# EAGLE design sunbird (EAGLE 9.2.2)

## Sheet 1 of 6: Battery Charger
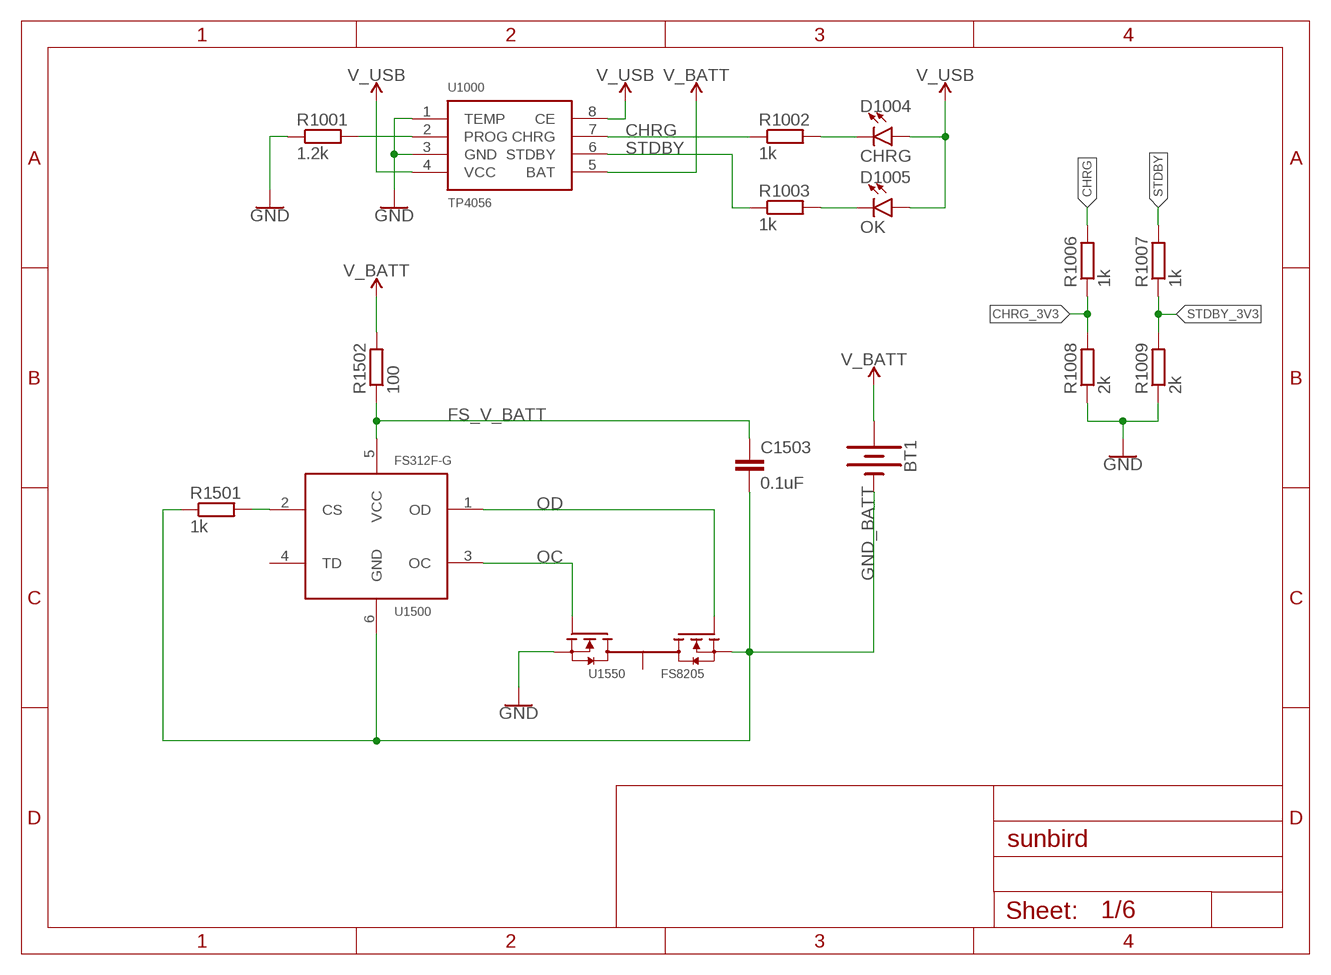
[diagram p0: schematic, sheet 1]

### Parts
BT1  BATTERY-18650  [BATTERY_18650-HOLDER]
C1503  0.1uF  C-EUC0603  [C0603]
D1004  CHRG  LED0603  [LED-0603]
D1005  OK  LED0603  [LED-0603]
R1001  1.2k  R-EU_R0603  [R0603]
R1002  1k  R-EU_R0603  [R0603]
R1003  1k  R-EU_R0603  [R0603]
R1006  1k  R-EU_R0603  [R0603]
R1007  1k  R-EU_R0603  [R0603]
R1008  2k  R-EU_R0603  [R0603]
R1009  2k  R-EU_R0603  [R0603]
R1501  1k  R-EU_R0603  [R0603]
R1502  100  R-EU_R0603  [R0603]
U1000  TP4056  [SOP-8-THERMAL]
U1500  FS312F-G  [SOT23-6]
U1550  FS8205  [SOT23-6]

### Nets
CHRG: R1002.1 R1006.2 U1000.7(CHRG)
CHRG_3V3: R1006.1 R1008.2 ; also sheet 3
FS_CS: R1501.2 U1500.2(CS)
FS_V_BATT: C1503.1 R1502.1 U1500.5(VCC)
GND: R1001.1 R1008.1 R1009.1 U1000.1(TEMP) U1000.3(GND) U1550.1(S1) ; also sheet 2,3,4,5
GND_BATT: BT1.GND@1(-) C1503.2 R1501.1 U1500.6(GND) U1550.3(S2)
N$4: R1001.2 U1000.2(PROG)
N$6: D1005.C R1003.2
N$7: D1004.C R1002.2
OC: U1500.3(OC) U1550.6(G1)
OD: U1500.1(OD) U1550.4(G2)
STDBY: R1003.1 R1007.2 U1000.6(STDBY)
STDBY_3V3: R1007.1 R1009.2 ; also sheet 3
V_BATT: BT1.PWR@1(+) R1502.2 U1000.5(BAT) ; also sheet 2,3
V_USB: D1004.A D1005.A U1000.4(VCC) U1000.8(CE) ; also sheet 5
Unconnected: U1500.4(TD) U1550.2(D12) U1550.5(D12)

## Sheet 2 of 6: Power Regulators
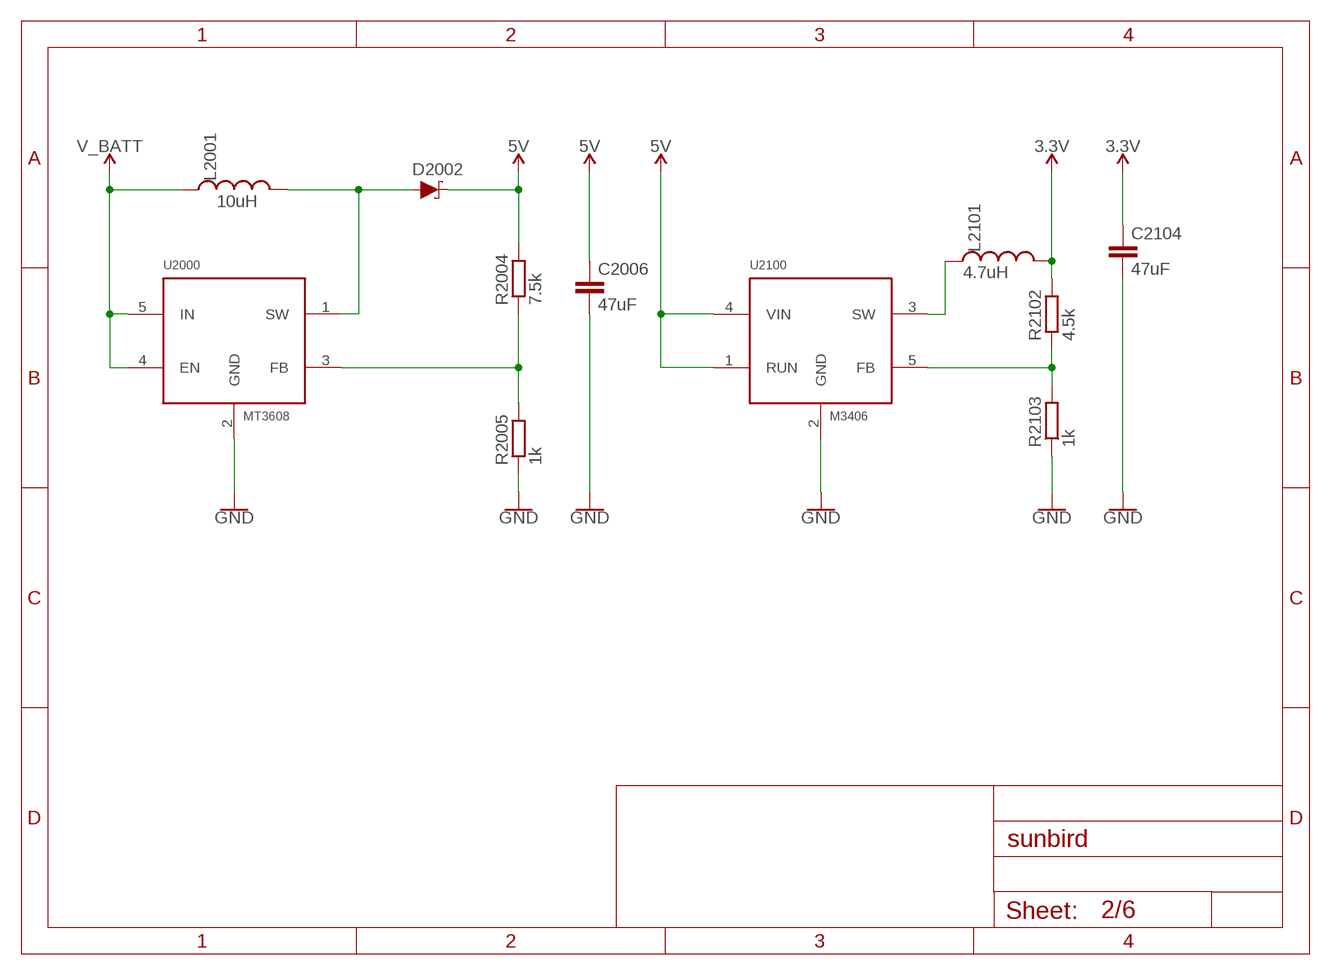
[diagram p1: schematic, sheet 2]

### Parts
C2006  47uF  C-EUC0603  [C0603]
C2104  47uF  C-EUC0603  [C0603]
D2002  DIODE-SCHOTTKY-PMEG4005EJ  [SOD-323]
L2001  10uH  INDUCTOR_3.0X3.03.0X3.0  [INDUCTOR_3.0X3.0]
L2101  4.7uH  INDUCTOR_3.0X3.03.0X3.0  [INDUCTOR_3.0X3.0]
R2004  7.5k  R-EU_R0603  [R0603]
R2005  1k  R-EU_R0603  [R0603]
R2102  4.5k  R-EU_R0603  [R0603]
R2103  1k  R-EU_R0603  [R0603]
U2000  MT3608  [SOT23-6]
U2100  M3406  [SOT23-5]

### Nets
3.3V: C2104.1 L2101.P$2 R2102.2 ; also sheet 3,5
5V: C2006.1 D2002.C R2004.2 U2100.1(RUN) U2100.4(VIN) ; also sheet 4
BUCK: D2002.A L2001.P$2 U2000.1(SW)
GND: C2006.2 C2104.2 R2005.1 R2103.1 U2000.2(GND) U2100.2(GND) ; also sheet 1,3,4,5
N$1: L2101.P$1 U2100.3(SW)
N$2: R2102.1 R2103.2 U2100.5(FB)
N$13: R2004.1 R2005.2 U2000.3(FB)
V_BATT: L2001.P$1 U2000.4(EN) U2000.5(IN) ; also sheet 1,3

### Notes on the sheet
- 10uH
- 4.7uH

## Sheet 3 of 6: Processor
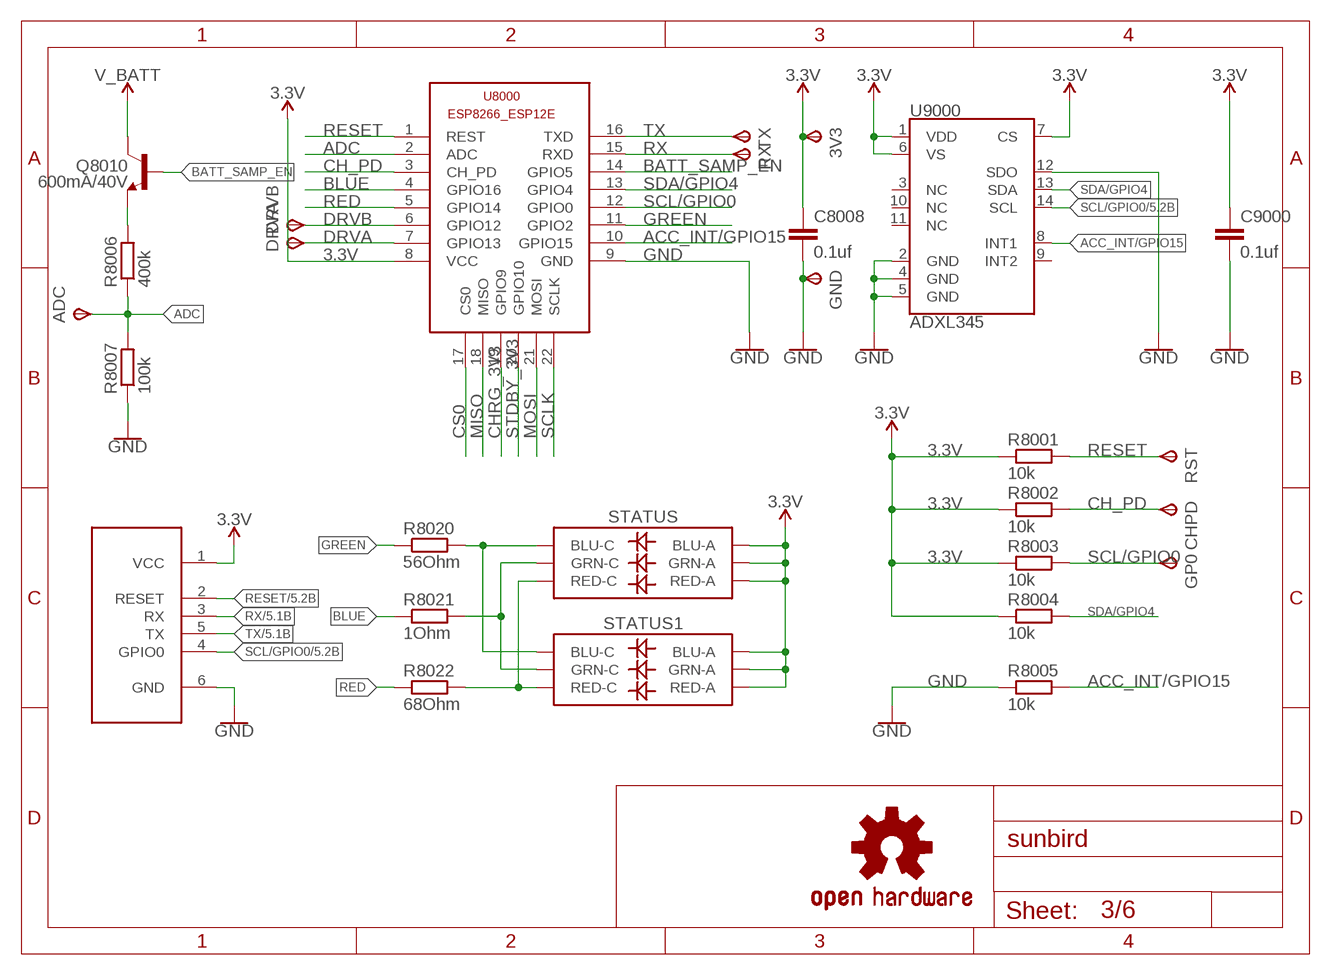
[diagram p2: schematic, sheet 3]

### Parts
3V3  TPSTP10R  [TP10R]
ADC  TPSTP10R  [TP10R]
C8008  0.1uf  C-EUC0603  [C0603]
C9000  0.1uf  C-EUC0603  [C0603]
CHPD  TPSTP10R  [TP10R]
DEBUG  ESP8266_PROGRAMMER  [TC2030-IDC-NL]
DRVA  TPSTP10R  [TP10R]
DRVB  TPSTP10R  [TP10R]
GND  TPSTP10R  [TP10R]
GP0  TPSTP10R  [TP10R]
LOGO1  OSHW-LOGOS  [OSHW-LOGO-S]
Q8010  600mA/40V  TRANS_NPN-MMBT2222AL  [SOT23-3]
R8001  10k  R-EU_R0603  [R0603]
R8002  10k  R-EU_R0603  [R0603]
R8003  10k  R-EU_R0603  [R0603]
R8004  10k  R-EU_R0603  [R0603]
R8005  10k  R-EU_R0603  [R0603]
R8006  400k  R-EU_R0603  [R0603]
R8007  100k  R-EU_R0603  [R0603]
R8020  56Ohm  R-EU_R0603  [R0603]
R8021  1Ohm  R-EU_R0603  [R0603]
R8022  68Ohm  R-EU_R0603  [R0603]
RST  TPSTP10R  [TP10R]
RX  TPSTP10R  [TP10R]
STATUS  LED-RGBNO_IC  [LED-TRICOLOR-5050]
STATUS1  LED-RGBNO_IC  [LED-TRICOLOR-5050]
TX  TPSTP10R  [TP10R]
U8000  ESP8266-12EESP8266-ESP12E  [ESP8266-ESP12E]
U9000  ADXL345  [LGA-14]

### Nets
3.3V: 3V3.TP(PP) C8008.1 C9000.1 DEBUG.1(VCC) R8001.1 R8002.1 R8003.1 R8004.1 STATUS1.1(GRN-A) STATUS1.2(RED-A) STATUS1.3(BLU-A) STATUS.1(GRN-A) STATUS.2(RED-A) STATUS.3(BLU-A) U8000.8(VCC) U9000.1(VDD) U9000.6(VS) U9000.7(CS) ; also sheet 2,5
ACC_INT/GPIO15: R8005.2 U8000.10(GPIO15) U9000.8(INT1)
ADC: ADC.TP(PP) R8006.1 R8007.2 U8000.2(ADC)
BATT_SAMP_EN: Q8010.1(B) U8000.14(GPIO5)
BLUE: R8021.1 U8000.4(GPIO16)
CH_PD: CHPD.TP(PP) R8002.2 U8000.3(CH_PD)
CHRG_3V3: U8000.19(GPIO9) ; also sheet 1
CS0: U8000.17(CS0)
DRVA: DRVA.TP(PP) U8000.7(GPIO13) ; also sheet 4
DRVB: DRVB.TP(PP) U8000.6(GPIO12) ; also sheet 4
GND: C8008.2 C9000.2 DEBUG.6(GND) GND.TP(PP) R8005.1 R8007.1 U8000.9(GND) U9000.2(GND) U9000.4(GND) U9000.5(GND) U9000.12(SDO) ; also sheet 1,2,4,5
GREEN: R8020.1 U8000.11(GPIO2)
MISO: U8000.18(MISO)
MOSI: U8000.21(MOSI)
N$9: Q8010.2(E) R8006.2
N$14: R8020.2 STATUS1.4(BLU-C) STATUS.4(BLU-C)
N$15: R8021.2 STATUS1.6(GRN-C) STATUS.6(GRN-C)
N$16: R8022.2 STATUS1.5(RED-C) STATUS.5(RED-C)
RED: R8022.1 U8000.5(GPIO14)
RESET: DEBUG.2(RESET) R8001.2 RST.TP(PP) U8000.1(REST) ; also sheet 5
RX: DEBUG.3(RX) RX.TP(PP) U8000.15(RXD) ; also sheet 5
SCL/GPIO0: DEBUG.4(GPIO0) GP0.TP(PP) R8003.2 U8000.12(GPIO0) U9000.14(SCL) ; also sheet 5
SCLK: U8000.22(SCLK)
SDA/GPIO4: R8004.2 U8000.13(GPIO4) U9000.13(SDA)
STDBY_3V3: U8000.20(GPIO10) ; also sheet 1
TX: DEBUG.5(TX) TX.TP(PP) U8000.16(TXD) ; also sheet 5
V_BATT: Q8010.3(C) ; also sheet 1,2
Unconnected: U9000.3(NC) U9000.9(INT2) U9000.10(NC) U9000.11(NC)

## Sheet 4 of 6: Motor Driver
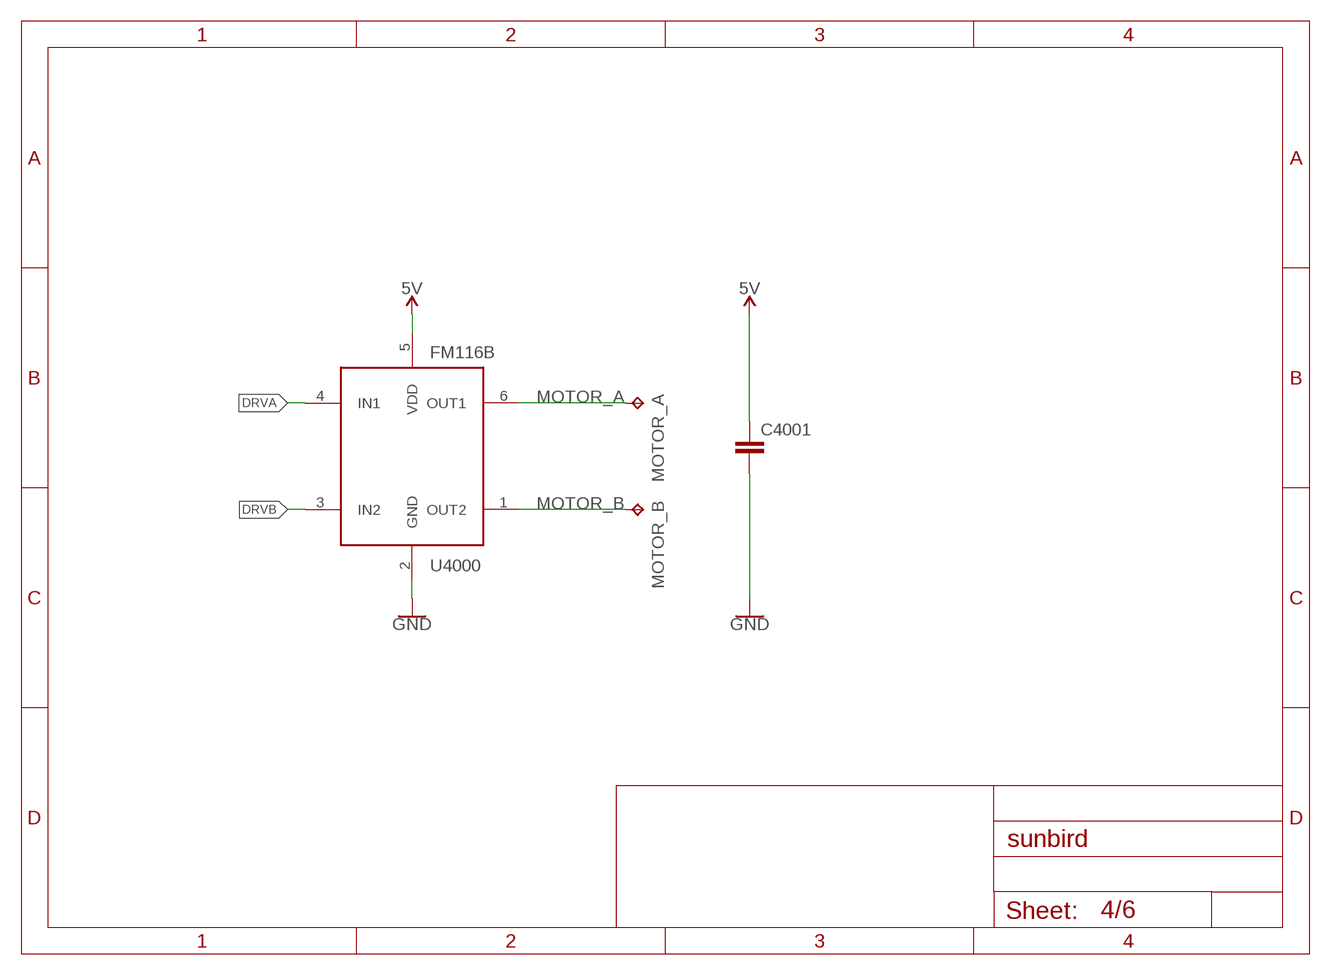
[diagram p3: schematic, sheet 4]

### Parts
C4001  C-EUC0603  [C0603]
MOTOR_A  TPTP20SQ  [TP20SQ]
MOTOR_B  TPTP20SQ  [TP20SQ]
U4000  FM116B  [SOT23-6]

### Nets
5V: C4001.1 U4000.5(VDD) ; also sheet 2
DRVA: U4000.4(IN1) ; also sheet 3
DRVB: U4000.3(IN2) ; also sheet 3
GND: C4001.2 U4000.2(GND) ; also sheet 1,2,3,5
MOTOR_A: MOTOR_A.TP U4000.6(OUT1)
MOTOR_B: MOTOR_B.TP U4000.1(OUT2)

## Sheet 5 of 6: USB/UART
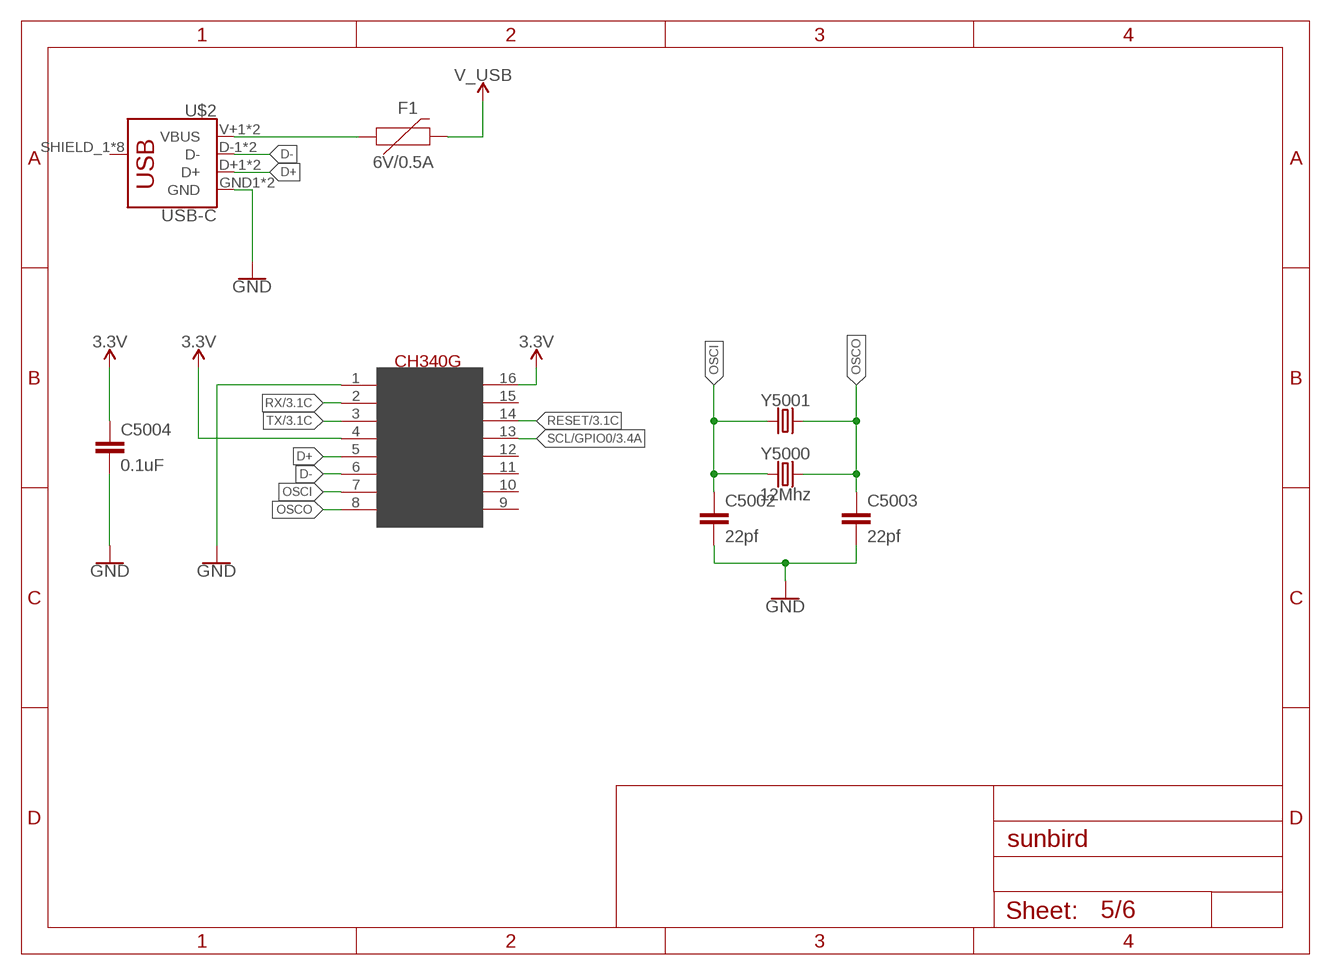
[diagram p4: schematic, sheet 5]

### Parts
C5002  22pf  C-EUC0603  [C0603]
C5003  22pf  C-EUC0603  [C0603]
C5004  0.1uF  C-EUC0603  [C0603]
F1  6V/0.5A  PPTC_HALF-AMP  [1206]
U5000  CH340G  [SOIC16]
U$2  USB-C  [USB_C-XKBENTERPRISEU262-16XN-4BVC11]
Y5000  12Mhz  CRYSTALSMD-HC49UP  [HC49UP]
Y5001  CRYSTALPTH-HC49UV  [HC49U]

### Nets
3.3V: C5004.1 U5000.4(V3) U5000.16(VCC) ; also sheet 2,3
D+: U5000.5(D+) U$2.D+1(D+) U$2.D+2(D+)
D-: U5000.6(D-) U$2.D-1(D-) U$2.D-2(D-)
GND: C5002.2 C5003.2 C5004.2 U5000.1(GND) U$2.GND1(GND) U$2.GND2(GND) ; also sheet 1,2,3,4
OSCI: C5002.1 U5000.7(XI) Y5000.1 Y5001.1
OSCO: C5003.1 U5000.8(XO) Y5000.2 Y5001.2
RESET: U5000.14(RTS) ; also sheet 3
RX: U5000.2(TX) ; also sheet 3
SCL/GPIO0: U5000.13(DTR) ; also sheet 3
TX: U5000.3(RX) ; also sheet 3
V_USB: F1.2 ; also sheet 1
V_USB_UNFUSED: F1.1 U$2.V+1(VBUS) U$2.V+2(VBUS)
Unconnected: U5000.9(CTS) U5000.10(DSR) U5000.11(RI) U5000.12(DCD) U5000.15(RS232) U$2.SHIELD_1(SHIELD) U$2.SHIELD_2(SHIELD) U$2.SHIELD_3(SHIELD) U$2.SHIELD_4(SHIELD) U$2.SHIELD_5(SHIELD) U$2.SHIELD_6(SHIELD) U$2.SHIELD_7(SHIELD) U$2.SHIELD_8(SHIELD)

## Sheet 6 of 6

## Library data of the parts
3V3 ADC CHPD DRVA DRVB GND GP0 RST RX TX = testpad:TPS: TEST PIN
BT1 = SparkFun-Batteries:BATTERY: Battery - Single Cell A variety of battery chemistries, sizes, and footprints. Device List: 20MM_PTH - Coin Cell Battery Holder - 20mm (PTH) <https://www.sparkfun.com/products/783> 6.8MM_PTH - Coin Cell Battery Holder - 6.8MM(SMD) <https://www.digikey.com/product-detail/en/seiko-instruments/MS621FE-FL11E/728-1057-ND/1889208?WT.srch=1&gclid=CNOQ5a6LzdQCFZS2wAodXCkE0g> 12MM_SMD - Coin Cell Battery Holder - 12mm (SMD) <https://www.sparkfun.com/products/10592> 12MM_PTH - Coin Cell Battery Holder - 12mm (PTH) <https://www.sparkfun.com/products/7948> 20MM_SMD - 20mm Coin Cell Battery Holder (SMD) (2 legs) Used on the Big Time Watch Kit <https://www.sparkfun.com/products/11734> 20MM_SMD_4LEGS - Coin Cell Battery Holder - 20mm (SMD) <https://www.sparkfun.com/products/11892> 20MM_SMD_4LEGS_OVERPASTE - Coin Cell Battery Holder - 20mm (SMD) <https://www.sparkfun.com/products/11892> (Over-paste on the legs) 24.5MM_PTH - Coin Cell Battery Holder - 24.5mm (PTH) <https://www.sparkfun.com/products/8863> 9V - 9V Battery Holder - PC Mount Used on the SparkFun SparkPunk Sound Kit <https://www.sparkfun.com/products/11177> and SparkFun SparkPunk Sequencer Kit <https://www.sparkfun.com/products/12707> 18650 - Battery Holder - 18650 (PTH) <https://www.sparkfun.com/products/13113> AA - Battery Holder - 1xAA (PTH) <https://www.sparkfun.com/products/7949> AAA - Battery Holder - 1xAAA (PTH) <https://www.sparkfun.com/products/12718> AA_KIT - Battery Holder - 1xAA (PTH) <https://www.sparkfun.com/products/7949> Special kit package - pads only have exposed copper on one side of the board. AAA_KIT - Battery Holder - 1xAAA (PTH) <https://www.sparkfun.com/products/12718> Special kit package - pads only have exposed copper on one side of the board.; PROD_ID: BATT-12327; SF_SKU: PRT-13113
C1503 C2006 C2104 C4001 C5002-C5004 C8008 C9000 = rcl:C-EU: CAPACITOR, European symbol; SPICEPREFIX: C
D1004 D1005 = SparkFun-LED:LED: LED (Generic) Standard schematic elements and footprints for 5mm, 3mm, 1206, and 0603 sized LEDs. Generic LEDs with no color specified.
D2002 = SparkFun-DiscreteSemi:DIODE-SCHOTTKY: Schottky diode A Schottky diode is a semiconductor diode which has a low forward voltage drop and a very fast switching action.; PROD_ID: DIO-10955; VALUE: 0.5A/40V/420mV
DEBUG = geusebio:ESP8266_PROGRAMMER
F1 = SparkFun-Fuses:PPTC: Resettable Fuse PPTC Resettable Fuse. Really a sort of resistor with a polymeric positive temperature coefficient whose resistance increases dramatically with an increase in temperature. When heated by the power passing through the resistance rises causing the current to be limited, protecting the circuit. This is achieved by the transition of the polymer from a crystalline to an amorphous state where the conductive carbon separates breaking the conductive pathways found in the cool crystalline structure. When a PPTC cools back down it resumes conducting letting the circuit turn back on. SparkFun Products: SparkFun RedBoard - Programmed with Arduino <https://www.sparkfun.com/products/12757> Pro Micro - 5V/16MHz <https://www.sparkfun.com/products/12640> Arduino Pro 328 - 5V/16MHz <https://www.sparkfun.com/products/10915> MP3 Trigger <https://www.sparkfun.com/products/13720>; PROD_ID: RES-08585
L2001 L2101 = geusebio:INDUCTOR_3.0X3.0
LOGO1 = SparkFun-Aesthetics:OSHW-LOGO: Open-Source Hardware (OSHW) Logo This logo indicates the piece of hardware it is found on incorporates a OSHW license and/or adheres to the definition of open source hardware found here: http://freedomdefined.org/OSHW
MOTOR_A MOTOR_B = testpad:TP: Test pad
Q8010 = SparkFun-DiscreteSemi:TRANS_NPN: NPN transistor Current controlled devices typically used to amplify current or used as a switch. BC547 - COM-08928 <http://www.sparkfun.com/products/8928> (TO-92 45V 100mA) (1.Collector 2.Base 3.Emitter) 2N3904 - COM-00521 <http://www.sparkfun.com/products/521> (TO-92 40V 200mA) (1.Emitter 2.Base 3.Collector) P2N2222A - COM-12852 <http://www.sparkfun.com/products/12852> (TO-92 40V 600mA) (1.Collector 2.Base 3.Emitter); PROD_ID: TRANS-08049
R1001-R1003 R1006-R1009 R1501 R1502 R2004 R2005 R2102 R2103 R8001-R8007 R8020-R8022 = rcl:R-EU_: RESISTOR, European symbol; SPICEPREFIX: R
STATUS STATUS1 = SparkFun-LED:LED-RGB: LED-RGB 6 pin RGB LED (no common connector) Packages: PLCC-6 LED-TRICOLOR-5050 - No built-in IC SparkFun Products: Digital Sandbox <https://www.sparkfun.com/products/12651> LED- SMD RGB <https://www.sparkfun.com/products/10866>; PROD_ID: DIO-10298
U1000 = geusebio:TP4056
U1500 = geusebio:FS312F-G
U1550 = geusebio:FS8205
U2000 = geusebio:MT3608
U2100 = geusebio:M3406
U4000 = geusebio:FM116B
U5000 = CH340G-USB-SERIAL:CH340G
U8000 = ESP8266-ESP12E:ESP8266-12E: ESP8266-12E with additional I/O and GPIO04/05 corrected The author cannot warrant that this library is free from error or will meet your specific requirements. Created by PuceBaboon.com. Komagane, Nagano, JAPAN
U9000 = SparkFun-Sensors:ADXL345: Analog Devices ADXL345 3-Axis SPI/I2C 2/4/8/16g Accelerometer The ADXL345 is a small, thin, low power, 3-axis accelerometer with high resolution (13-bit) measurement at up to ±16g. Digital output data is formatted as 16-bit twos complement and is accessible through either a SPI (3- or 4-wire) or I2C digital interface. Datasheet <https://www.sparkfun.com/datasheets/Sensors/Accelerometer/ADXL345.pdf> SparkFun Products SparkFun Triple Axis Accelerometer Breakout - ADXL345 <https://www.sparkfun.com/products/9836> (SEN-09836) Triple Axis Accelerometer - ADXL345 <https://www.sparkfun.com/products/9045> (SEN-09045) SparkFun 6 Degrees of Freedom IMU Digital Combo Board - ITG3200/ADXL345 <https://www.sparkfun.com/products/10121> (SEN-10121); PROD_ID: IC-09097; SF_ID: SEN-09045
U$2 = geusebio:USB-C
Y5000 Y5001 = SparkFun-Clocks:CRYSTAL: Crystals (Generic) These are passive quartz crystals, which can be used as a clock source for a microcontroller. Crystal's are two-terminal devices. They require external "load" capacitors to generate an oscillating signal.

## Board
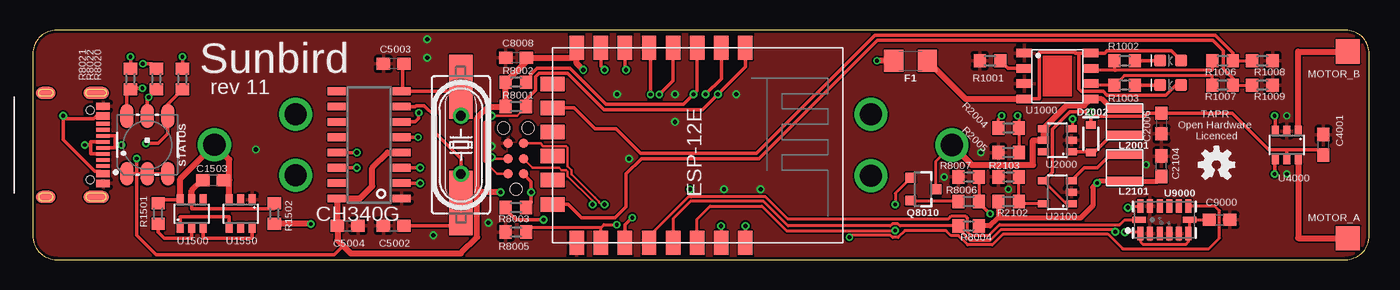
[diagram p5: board, top side]
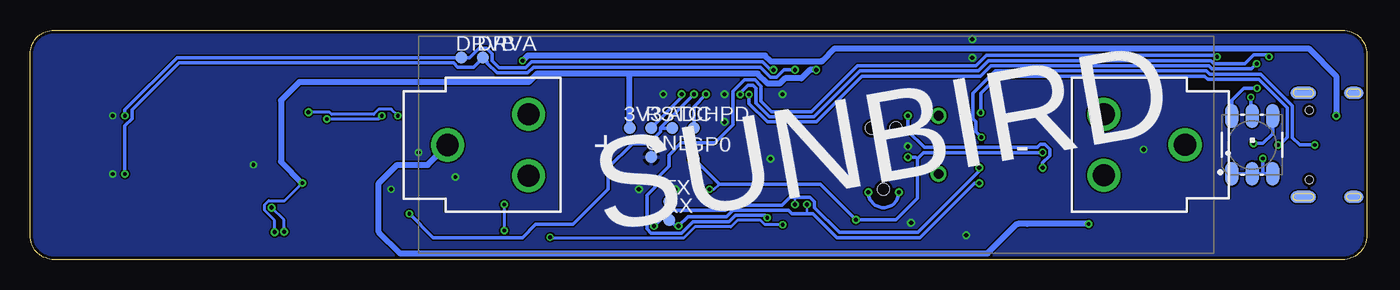
[diagram p6: board, bottom side, seen from below]

Size 111 x 19.05 mm. Coordinates in mm from the lower left corner, seen from the top.
Outline: 0,17.05 0,2 arc90 2,0 109,0 arc90 111,2 111,17.05 arc90 109,19.05 2,19.05 arc90 0,17.05
Copper layers (1*16): Top 0.035mm / dielectric 1.5mm / Bottom 0.035mm
Design rules "dirtypcbs": minimum track width 5mil, minimum drill 12mil, track to track 5mil, track to pad 5mil, pad to pad 5mil, via to via 5mil, smd to smd 0mil, copper to edge 10mil, drill to drill 10mil, minimum pad ring 10mil, minimum via ring 6mil, stop-mask expansion 2mil, vias tented up to drill 25mil, thermal gap 10mil
tKeepout: area 0,17.8 to 111,19; area 0,0 to 111,1.3
bKeepout: area 81,0 to 111,19.1

### Footprints (pad centres in the part's own frame; a part is rotated, then mirrored left to right if it is on the bottom)
TP10R = smd 1 x 1: TP 0,0
BATTERY_18650-HOLDER = drill 1.829: GND@1 30.628,0.01; GND@2 23.88,2.55; GND@3 23.88,-2.53; PWR@1 -30.628,-0.01; PWR@2 -23.88,2.53; PWR@3 -23.88,-2.55
C0603 = smd 1.1 x 1: 1 -0.85,0; 2 0.85,0
LED-0603 = smd 1 x 1: A -0.877,0; C 0.877,0
SOD-323 = smd 0.63 x 0.83: A 1.15,0; C -1.15,0
TC2030-IDC-NL = smd 0.787 x 0.787: 1 -1.27,-0.635; 2 -1.27,0.635; 3 0,-0.635; 4 0,0.635; 5 1.27,-0.635; 6 1.27,0.635 | hole 0.991: -2.54,0; 2.54,1.016; 2.54,-1.016
1206 = smd 1.6 x 1.8: 1 -1.4,0; 2 1.4,0
INDUCTOR_3.0X3.0 = smd 0.75 x 3: P$1 -1.125,0; P$2 1.125,0
TP20SQ = smd 2 x 2: TP 0,0
SOT23-3 = smd 0.8 x 0.9: 1 -0.95,-1; 2 0.95,-1; 3 0,1.1
R0603 = smd 1 x 1.1: 1 -0.85,0; 2 0.85,0
LED-TRICOLOR-5050 = smd 2 x 1.1: 1 -2.4,1.7; 2 -2.4,0; 3 -2.4,-1.7; 4 2.4,-1.7; 5 2.4,0; 6 2.4,1.7
SOP-8-THERMAL = smd 1.3 x 0.7: 1 -2.75,1.905; 2 -2.75,0.635; 3 -2.75,-0.635; 4 -2.75,-1.905; 5 2.75,-1.905; 6 2.75,-0.635; 7 2.75,0.635; 8 2.75,1.905
SOT23-6 = smd 0.6 x 0.9: 1 -0.95,-1.15; 2 0,-1.15; 3 0.95,-1.15; 4 0.95,1.15; 5 0,1.15; 6 -0.95,1.15
SOT23-5 = smd 0.6 x 0.9: 1 -0.95,-1.15; 2 0,-1.15; 3 0.95,-1.15; 4 0.95,1.15; 5 -0.95,1.15
SOIC16 = smd 0.635 x 1.524: 1 -4.445,-2.695; 2 -3.175,-2.695; 3 -1.905,-2.695; 4 -0.635,-2.695; 5 0.635,-2.695; 6 1.905,-2.695; 7 3.175,-2.695; 8 4.445,-2.695; 9 4.445,2.695; 10 3.175,2.695; 11 1.905,2.695; 12 0.635,2.695; 13 -0.635,2.695; 14 -1.905,2.695; 15 -3.175,2.695; 16 -4.445,2.695
ESP8266-ESP12E = smd 2 x 1.2: 1 0,16; 2 0,14; 3 0,12; 4 0,10; 5 0,8; 6 0,6; 7 0,4; 8 0,2; 9 16.2,2; 10 16.2,4; 11 16.2,6; 12 16.2,8; 13 16.2,10; 14 16.2,12; 15 16.2,14; 16 16.2,16 | smd 1.2 x 2: 17 11,0; 18 3,0; 19 5,0; 20 13,0; 21 7,0; 22 9,0
LGA-14 = smd 0.5 x 1.124: 1 2,1.138; 2 1.2,1.138; 3 0.4,1.138; 4 -0.4,1.138; 5 -1.2,1.138; 6 -2,1.138; 8 -2,-1.13; 9 -1.2,-1.138; 10 -0.4,-1.138; 11 0.4,-1.138; 12 1.2,-1.138; 13 2,-1.138 | smd 1.124 x 0.5: 7 -2.1,0; 14 2.1,0
USB_C-XKBENTERPRISEU262-16XN-4BVC11 = smd 0.3 x 1.15: CC1 -1.25,0; CC2 1.75,0; D+1 -0.25,0; D+2 0.75,0; D-1 -0.75,0; D-2 0.25,0; SBU1 1.25,0; SBU2 -1.75,0 | smd 0.6 x 1.15: GND1 -3.2,0; GND2 3.2,0; V+1 -2.4,0; V+2 2.4,0 | smd 1 x 1.6 bottom: SHIELD_1 -4.32,-4.755; SHIELD_8 4.32,-4.755 | smd 1 x 2.1 bottom: SHIELD_2 -4.32,-0.575; SHIELD_7 4.32,-0.575 | smd 1 x 1.6: SHIELD_3 -4.32,-4.755; SHIELD_6 4.32,-4.755 | smd 1 x 2.1: SHIELD_4 -4.32,-0.575; SHIELD_5 4.32,-0.575 | hole 0.65: -2.89,-1.075; 2.89,-1.075
HC49UP = smd 5.334 x 1.93: 1 -4.826,0; 2 4.826,0
HC49U = drill 0.813: 1 -2.413,0; 2 2.413,0

### Placement (x,y rotation side)
3V3  61.21,10.92 0 bottom
ADC  57.66,10.92 0 bottom
BT1  45.72,9.53 0 bottom
C1503  14.99,6.6 0 top
C2006  93.73,11.3 270 top
C2104  93.73,7.75 90 top
C4001  107.19,9.53 90 top
C5002  29.97,2.79 180 top
C5003  29.97,16.26 180 top
C5004  26.16,2.79 0 top
C8008  40.13,16.76 180 top
C9000  98.55,3.3 0 top
CHPD  55.88,10.92 0 bottom
D1004  94.49,16.51 180 top
D1005  94.49,14.48 180 top
D2002  87.88,10.03 270 top
DEBUG  40.13,8.38 90 top
DRVA  73.41,16.76 0 bottom
DRVB  75.18,16.76 0 bottom
F1  72.9,16.51 0 top
GND  59.44,8.51 0 bottom
GP0  55.88,8.38 0 bottom
L2001  90.68,11.43 270 top
L2101  90.68,7.62 270 top
LOGO1  98.3,7.87 0 top
MOTOR_A  109.22,1.78 0 top
MOTOR_B  109.22,17.27 0 top
Q8010  73.91,5.84 270 top
R1001  79.5,16.51 0 top
R1002  90.68,16.51 0 top
R1003  90.68,14.48 0 top
R1006  98.81,16.51 180 top
R1007  98.81,14.48 180 top
R1008  102.11,16.51 180 top
R1009  102.11,14.48 180 top
R1501  10.41,3.81 270 top
R1502  20.07,3.81 270 top
R2004  81.03,10.92 180 top
R2005  81.03,8.89 0 top
R2102  81.03,4.83 180 top
R2103  81.03,6.86 0 top
R8001  40.13,12.7 0 top
R8002  40.13,14.73 0 top
R8003  40.13,4.32 180 top
R8004  77.72,2.79 180 top
R8005  40.13,2.29 0 top
R8006  77.72,4.83 180 top
R8007  77.72,6.86 0 top
R8020  12.45,14.99 270 top
R8021  8.13,14.99 270 top
R8022  10.29,14.99 270 top
RST  59.44,10.92 0 bottom
RX  57.91,3.3 0 bottom
STATUS  9.53,9.53 90 top
STATUS1  9.53,9.53 90 bottom
TX  57.91,4.83 0 bottom
U1000  85.09,15.24 0 top
U1500  13.21,3.81 0 top
U1550  17.27,3.81 180 top
U2000  85.09,9.91 90 top
U2100  85.09,5.59 90 top
U4000  104.14,9.53 180 top
U5000  27.94,9.53 90 top
U8000  43.18,17.59 270 top
U9000  93.98,3.3 180 top
U$2  5.84,9.53 270 top
Y5000  35.56,9.53 90 top
Y5001  35.56,9.53 90 top

### Tracks (layer width: path | path; a pad name or v marks a point on that pad's centre or on a via)
3.3V  (via drill 0.3, 0.35)
  Top 0.254: v90.7,2.29 91.86,2.29 U9000.1 91.98,1.49 92.2,1.27 95.76,1.27 95.98,1.49 U9000.6 96.08,2.26 U9000.7 C9000.1
  Top 0.305: DEBUG.1 41.4,6.48 v41.4,5.59 41.4,4.74 R8003.1 | 45.18,17.27 U8000.8 | 25.78,1.14 25.04,0.41 10.26,0.41 8.64,2.03 8.64,7.12 | STATUS1.3 STATUS1.2 | STATUS1.2 STATUS1.1 | STATUS1.2 8.64,7.12 | 8.64,7.12 v8.64,8.38
  Top 0.406: C2104.1 93.32,6.5 L2101.P$2 88.54,6.5 v88.39,6.35 88.04,5.99 88.04,4.46 87.02,3.44 80.15,3.44 | 80.15,3.44 80.18,3.47 R2102.2 | 80.15,3.44 79.5,2.79 R8004.1
  Top 0.508: v45.72,15.75 45.18,16.29 45.18,17.27 | 36.91,5.59 36.91,1.87 35.54,0.51 26.42,0.51 25.78,1.14 25.31,1.61 C5004.1 25.31,5.01 U5000.16 27.18,5.08 28.19,6.1 28.19,7.62 29.46,8.89 U5000.4 | v38.86,5.59 36.91,5.59 | 36.91,5.59 36.91,11.76 37.85,12.7 R8001.1 R8002.1 40.98,16.43 C8008.1 45.18,16.76 U8000.8
  Bottom 0.254: v88.39,6.35 89.84,4.9 91.17,4.9 91.51,4.56 91.51,4.08 90.7,3.26 v90.7,2.29
  Bottom 0.305: v38.86,5.59 arc180 v41.4,5.59 | STATUS1.3 8.64,7.12 | 8.64,7.12 STATUS1.2 STATUS1.1 | v8.64,8.38 8.64,7.12
  Bottom 0.508: 61.21,15.44 50.58,15.44 49.75,14.61 48.77,14.61 48.34,15.04 46.95,15.04 46.24,15.75 v45.72,15.75 | 3V3.TP 61.21,15.44 | 61.21,15.44 68.89,15.44 69.6,14.73 88.65,14.73 90.17,13.21 90.17,8.13 v88.39,6.35
5V  (via drill 0.3, 0.35)
  Top 0.254: R2004.2 80.18,11.66 v80.45,11.94 | U2100.4 85.84,4.64 U2100.1
  Top 0.305: D2002.C v87.88,12.24 | C4001.1 106.76,9.1 104.14,9.1 | 104.14,9.1 102.66,9.1 99.61,12.15 C2006.1 92.55,12.15 92.29,11.9 88.23,11.9 v87.88,12.24 | U4000.5 104.14,9.1 | U2100.4 84.67,7.27 84.67,10.82 86.12,12.27 87.86,12.27 v87.88,12.24
  Bottom 0.254: v80.45,11.94 81.01,12.5 82.04,12.5 82.47,12.06 85.95,12.06 86.13,12.24 v87.88,12.24
ACC_INT/GPIO15  (via drill 0.3)
  Top 0.254: U8000.10 47.18,2.64 | R8005.2 40.98,2.64 47.18,2.64 | 47.18,2.64 47.43,2.9 v48.51,2.9 | v67.82,1.85 68,2.03 71.22,2.03 71.4,1.85 71.86,1.85 72.42,2.41 75.85,2.41 76.27,1.99 76.89,1.99 77.65,1.23 79.69,1.23 80.59,2.13 89.27,2.13 90.52,0.89 97.66,0.89 98.55,1.78 98.55,4.06 98.18,4.43 U9000.8
  Bottom 0.254: v48.51,2.9 49.99,2.9 50.34,3.25 50.34,3.26 52.27,3.26 52.81,2.72 55.79,2.72 56.73,1.78 58.92,1.78 58.93,1.78 67.74,1.78 v67.82,1.85
ADC  (via drill 0.3, 0.35)
  Top 0.254: R8007.2 R8006.1
  Top 0.305: U8000.2 57.18,15.02 v55.88,13.72 | v79.5,3.81 78.57,4.74 R8006.1
  Bottom 0.305: 58.66,10.92 58.66,10.6 59.62,9.63 60.98,9.63 62.99,7.62 62.99,5.84 65.91,2.92 69.01,2.92 70.1,1.83 77.52,1.83 v79.5,3.81 | 58.66,10.92 58.66,10.94 v55.88,13.72 | ADC.TP 58.66,10.92
BATT_SAMP_EN  (via drill 0.3)
  Top 0.254: U8000.14 55.18,3.36 56.26,4.45 60.55,4.45 62.58,2.41 v71.63,2.41 | Q8010.1 71.63,5.51 v71.63,4.57
  Bottom 0.254: v71.63,4.57 v71.63,2.41
BLUE  (via drill 0.3)
  Top 0.305: v52.05,13.72 53.18,14.85 U8000.4 | v8.13,16.84 R8021.1
  Bottom 0.305: v52.05,13.72 52.05,13.81 51.37,14.48 50.98,14.48 50.72,14.22 50.72,12.98 49.6,11.86 45.9,11.86 42.09,15.67 32.27,15.67 31.41,16.52 12.96,16.52 12.69,16.26 10.13,16.26 9.4,16.99 8.28,16.99 v8.13,16.84
BUCK
  Top 0.305: U2000.1 87.88,8.96 | 87.88,8.96 D2002.A | L2001.P$2 89.55,10.3 88.2,8.96 87.88,8.96
CH_PD  (via drill 0.35)
  Top 0.305: R8002.2 41.33,15.08 41.33,15.35 41.88,15.9 44.6,15.9 47.63,12.88 54.03,12.88 v54.86,13.72 55.18,14.03 U8000.3
  Bottom 0.305: CHPD.TP 55.88,12.7 v54.86,13.72
CHRG
  Top 0.254: R1006.2 97.96,15.71 89.92,15.71 | U1000.7 87.84,15.71 89.92,15.71 | R1002.1 89.83,15.71 89.92,15.71
CHRG_3V3
  Top 0.254: R1006.1 R1008.2
  Top 0.305: U8000.19 44.96,12.59 46.7,10.85 48.44,10.85 50.47,8.81 60.12,8.81 69.95,18.64 98.2,18.64 99.66,17.18 R1006.1
D+  (via drill 0.3)
  Top 0.305: v32,10.16 U5000.5 | U$2.D+2 4.83,8.78 4.83,9.4 4.83,9.53 | 4.83,9.53 4.83,9.78 U$2.D+1 | v4.32,9.53 4.83,9.53
  Bottom 0.305: v32,10.16 32.45,10.6 32.45,11.43 32.7,11.68 32.7,13.79 30.84,15.66 13.31,15.66 13.05,15.39 8.79,15.39 6.17,12.78 6.17,10.11 5.59,9.53 v4.32,9.53
D-  (via drill 0.3)
  Top 0.305: v32.07,12.19 32.07,11.75 31.75,11.43 U5000.6 | U$2.D-2 6.86,9.28 6.86,9.53 | U$2.D-1 6.86,10.28 6.86,9.65 6.86,9.53 | v7.37,9.53 6.86,9.53
  Bottom 0.305: v32.07,12.19 32.07,13.82 30.66,15.23 13.49,15.23 13.22,14.96 8.97,14.96 6.6,12.6 6.6,10.16 7.24,9.53 v7.37,9.53
DRVA  (via drill 0.3, 0.35)
  Top 0.305: U8000.7 47.18,16.07 v47.5,15.75 | U4000.4 103.12,8.31 v103.12,7.11
  Bottom 0.305: v47.5,15.75 48.41,15.75 49.02,15.14 49.53,15.14 50.36,15.98 69.2,15.98 69.68,15.49 72.24,15.49 73.06,16.31 73.06,16.42 DRVA.TP 74.19,15.98 75.51,15.98 75.85,16.33 98.63,16.33 102.54,12.42 102.54,11.7 103.12,11.11 v103.12,7.11
DRVB  (via drill 0.3, 0.35)
  Top 0.305: U8000.6 49.18,15.84 v49.28,15.75 | v103.12,11.94 103.19,11.87 U4000.3
  Bottom 0.305: v49.28,15.75 49.52,15.75 50.18,16.41 69.38,16.41 69.86,15.93 72.06,15.93 72.63,16.49 72.63,17.09 73.08,17.54 73.73,17.54 74.51,16.76 DRVB.TP 98.81,16.76 103.12,12.45 v103.12,11.94
FS_CS
  Top 0.305: U1500.2 13.21,1.78 10.92,1.78 10.41,2.29 R1501.2
FS_V_BATT
  Top 0.305: U1500.5 13.21,4.21 20.07,4.21 R1502.1
  Top 0.508: U1500.5 13.21,5.75 14.06,6.6 C1503.1
GND  (via drill 0.3, 0.35)
  other vias: 49.53,8.38 33.27,2.03 32.77,18.29 38.1,9.4 37.85,3.05 32.77,16.76 48.51,13.72 53.34,11.43 53.34,13.72 18.54,9.14 60.45,5.84 57.4,5.84 92.46,7.87 104.14,7.11 104.14,11.94 78.74,8.89 75.69,6.86 81.03,5.84 58.42,13.72
  pour Top: -7.62,21 123.44,21 123.44,-1 -7.62,-1
  pour Bottom: -5.33,20 126.49,20 126.49,-2 -5.33,-2
GND_BATT
  Top 0.305: U1500.6 10.71,4.96 R1501.1
  Top 0.508: U1550.3 16.32,6.6 | 16.32,6.6 16.32,8.3 BT1.GND@1 12.26,6.7 U1500.6 | C1503.2 16.32,6.6
GREEN  (via drill 0.3)
  Top 0.305: U8000.11 49.18,2.88 v49.78,3.48 | v12.45,16.84 R8020.1
  Bottom 0.305: v49.78,3.48 49.97,3.67 52.44,3.67 52.98,3.12 55.96,3.12 56.9,2.19 59.43,2.19 59.79,2.54 59.79,5.33 59.1,6.03 59.1,6.6 57.95,7.75 57.95,8.68 56.94,9.7 54.11,9.7 52.63,11.18 52.63,13.96 51.68,14.91 50.8,14.91 50.29,14.4 50.29,13.16 49.43,12.29 46.13,12.29 42.32,16.1 32.44,16.1 31.59,16.95 17.02,16.95 16.92,16.95 12.56,16.95 v12.45,16.84
MOTOR_A
  Top 0.508: U4000.6 105.09,1.78 MOTOR_A.TP
MOTOR_B
  Top 0.508: U4000.1 105.09,17.27 MOTOR_B.TP
N$1
  Top 0.305: U2100.3 87.32,7.62 88.39,7.62 89.52,8.74 L2101.P$1
N$2
  Top 0.254: R2103.2 R2102.1 82.06,4.64 U2100.5
N$4
  Top 0.305: U1000.2 80.99,15.88 R1001.2
N$6
  Top 0.305: R1003.2 D1005.C
N$7
  Top 0.305: R1002.2 D1004.C
N$9
  Top 0.254: Q8010.2 76.87,4.89 R8006.2
N$13  (via drill 0.3)
  Top 0.254: U2000.3 86.36,10.98 v86.36,11.68 | v81.79,11.94 81.88,11.85 R2004.1 R2005.2
  Bottom 0.254: v86.36,11.68 82.04,11.68 v81.79,11.94
N$14  (via drill 0.3)
  Top 0.305: R8020.2 11.22,12.91 STATUS.4 11.22,10.46 10.41,9.65 v9.4,9.65
  Bottom 0.305: v9.4,9.65 8.64,9.65 7.83,10.46 STATUS1.4
N$15  (via drill 0.3)
  Top 0.305: STATUS.6 7.83,13.83 R8021.2 8.13,14.22 v9.12,14.22
  Bottom 0.305: STATUS1.6 11.22,13.21 10.21,14.22 v9.12,14.22
N$16  (via drill 0.3)
  Top 0.305: R8022.2 v9.63,13.48 9.53,13.37 STATUS1.5
  Bottom 0.305: v9.63,13.48 9.63,12.03 STATUS1.5
OC
  Top 0.305: U1500.3 14.16,1.78 18.22,1.78 U1550.6
OD
  Top 0.305: U1500.1 12.26,3.56 16.32,3.56 U1550.4
OSCI
  Top 0.305: Y5000.1 35.56,5.08 | 35.56,5.08 Y5001.1 35.56,8.38 33.44,10.5 33.44,11.85 32.51,12.78 31.83,12.78 31.75,12.7 U5000.7 | C5002.1 35.56,2.79 35.56,5.08
OSCO
  Top 0.305: Y5000.2 35.56,13.97 | 35.56,13.97 Y5001.2 | U5000.8 30.73,13.97 | 30.73,13.97 35.56,13.97 | C5003.1 30.73,16.26 30.73,13.97
RED  (via drill 0.3)
  Top 0.305: v51.31,13.72 51.31,17.46 U8000.5 | v9.14,16.26 9.87,16.26 R8022.1
  Bottom 0.305: v51.31,13.72 51.31,12.95 49.78,11.43 45.72,11.43 41.91,15.24 32.09,15.24 31.23,16.09 13.13,16.09 12.87,15.82 9.58,15.82 v9.14,16.26
RESET  (via drill 0.35)
  Top 0.203: R8001.2 40.2,11.92 38.69,11.92 38.67,11.94 v38.1,11.94 37.54,11.38 37.54,8.15 38.58,7.11 DEBUG.2
  Top 0.305: R8001.2 40.98,13.29 41.76,14.07 41.76,15.17 42.06,15.47 44.43,15.47 47.45,12.45 55.63,12.45 v56.9,13.72 59.18,16 U8000.1 | U5000.14 v26.92,7.62
  Bottom 0.305: v26.92,7.62 26.92,8.03 26.32,8.64 26.32,9.14 26.75,9.58 27.1,9.58 27.35,9.32 36.75,9.32 38.1,10.67 v38.1,11.94 | RST.TP 56.9,13.46 v56.9,13.72
RX  (via drill 0.35)
  Top 0.203: DEBUG.3 41.53,7.62 43.73,7.62 43.93,7.42 44.27,7.42 44.41,7.28 44.41,6.94 46.48,4.87 v46.48,4.57
  Top 0.305: U5000.2 v32.19,6.35 | v57.15,2.79 57.18,2.76 U8000.15
  Bottom 0.203: v46.48,4.57 46.48,3.81
  Bottom 0.305: RX.TP 57.4,2.79 v57.15,2.79 56.39,3.56 53.16,3.56 52.62,4.1 48.04,4.1 47.75,3.81 46.48,3.81 45.97,3.81 43.99,1.83 43.66,1.83 37.34,1.83 37.11,1.83 32.59,6.35 v32.19,6.35
SCL/GPIO0  (via drill 0.3, 0.35)
  Top 0.203: v38.1,8.51 38.23,8.38 DEBUG.4
  Top 0.254: 54.71,5.21 60.86,5.21 62.72,3.35 76.02,3.35 76.27,3.6 77.48,3.6 77.63,3.45 77.63,2.33 77.97,1.99 79.37,1.99 80.28,2.9 90.27,2.9 90.68,3.3 U9000.14 | 54.71,5.21 54.45,5.21 51.18,1.94 U8000.12 | 54.71,5.21 54.58,5.33 v54.58,5.84
  Top 0.305: v26.92,8.89 U5000.13 | v42.42,3.3 40.13,3.3 39.28,4.15 R8003.2
  Bottom 0.254: v54.58,5.84 54.2,5.84 53.77,6.27
  Bottom 0.305: 37.34,8.38 36.83,8.89 v26.92,8.89 | GP0.TP 53.77,6.27 45.36,6.27 42.42,3.33 v42.42,3.3 39.12,3.3 37.34,5.08 37.34,8.38 | v38.1,8.51 37.47,8.51 37.34,8.38
SDA/GPIO4  (via drill 0.35)
  Top 0.254: U8000.13 53.18,3.4 54.61,4.83 60.71,4.83 62.74,2.79 71.22,2.79 71.4,2.97 71.86,2.97 72.04,2.79 R8004.2 77.25,2.42 77.25,2.17 77.81,1.61 79.53,1.61 80.43,2.52 89.72,2.52 v89.92,2.31 | v90.93,4.32 91.05,4.44 U9000.13
  Bottom 0.254: v89.92,2.31 89.92,3.3 v90.93,4.32
STDBY
  Top 0.254: R1007.2 97.96,15.28 90.63,15.28 89.87,14.52 | 89.87,14.52 R1003.1 | U1000.6 87.92,14.52 89.87,14.52
STDBY_3V3
  Top 0.254: R1007.1 R1009.2
  Top 0.305: U8000.20 44.45,4.59 45.56,3.48 48.35,3.48 49.28,4.41 49.28,7.11 50.55,8.38 60.3,8.38 70.13,18.21 98.02,18.21 98.88,17.35 98.88,15.84 99.66,15.06 R1007.1
TX  (via drill 0.35)
  Top 0.203: DEBUG.5 42.16,9.65 42.4,9.42 44.27,9.42 44.41,9.28 44.41,7.75 44.74,7.42 44.74,7.08 46.69,5.13 46.71,5.13 47.04,4.8 47.04,4.78 47.24,4.57 v47.5,4.57
  Top 0.305: U8000.16 v59.18,2.79 | v32.19,7.62 U5000.3
  Bottom 0.203: 47.5,5.18 v47.5,4.57
  Bottom 0.305: 57.91,4.08 53.25,4.08 52.8,4.53 48.55,4.53 47.91,5.18 47.5,5.18 46.23,5.18 45.88,4.82 45.88,4.32 43.81,2.26 37.28,2.26 32.19,7.36 v32.19,7.62 | v59.18,2.79 58.69,3.29 58.69,3.62 58.23,4.08 57.91,4.08 | TX.TP 57.91,4.08
V_BATT  (via drill 0.3)
  Top 0.254: Q8010.3 75.01,8.18 BT1.PWR@1
  Top 0.406: L2001.P$1 89.55,12.55 88.77,13.34 U1000.5
  Top 0.508: v23.11,2.96 R1502.2 | BT1.PWR@1 77.99,7.87 83.06,7.87 83.06,9.91 U2000.5 U2000.4 85.89,12.8 87.31,12.8 U1000.5
  Bottom 0.508: v23.11,2.96 28.19,2.96 28.96,2.96 29.05,2.96 31.5,0.51 80.26,0.51 82.04,2.29 82.04,6.35 80.52,7.87 77.99,7.87 BT1.PWR@1
V_USB
  Top 0.305: 86.87,17.14 U1000.8 89.02,17.14 89.21,17.34 94.54,17.34 D1004.A | 86.87,17.14 86.57,17.14 86.57,17.22 83.61,17.22 83.61,13.34 U1000.4 | D1005.A 94.92,14.48 94.09,13.65 89.21,13.65 88.89,13.97 87.08,13.97 86.87,14.18 86.87,17.14
  Top 0.508: F1.2 77.47,13.34 U1000.4
V_USB_UNFUSED  (via drill 0.3, 0.35)
  Top 0.305: U$2.V+1 5.31,11.93 5.07,11.68 2.79,11.68 v2.54,11.94 2.54,9.96 5.15,7.35 5.62,7.35 U$2.V+2
  Top 0.508: F1.1 v70.1,16.51
  Bottom 0.305: 45.27,16.46 45.21,16.51
  Bottom 0.508: 45.21,16.51 44.2,17.53 4.83,17.53 2.54,15.24 v2.54,11.94 | v70.1,16.51 69.67,16.94 49.96,16.94 49.48,16.46 45.27,16.46

### Text on the board
tNames: Sunbird | rev 11 | TAPR / Open Hardware / Licenced
bNames: SUNBIRD
Measures: 19.05mm | 111mm